# Altium schematic sheet power.SchDoc
size A; SheetNumber: 2; SheetTotal: 9
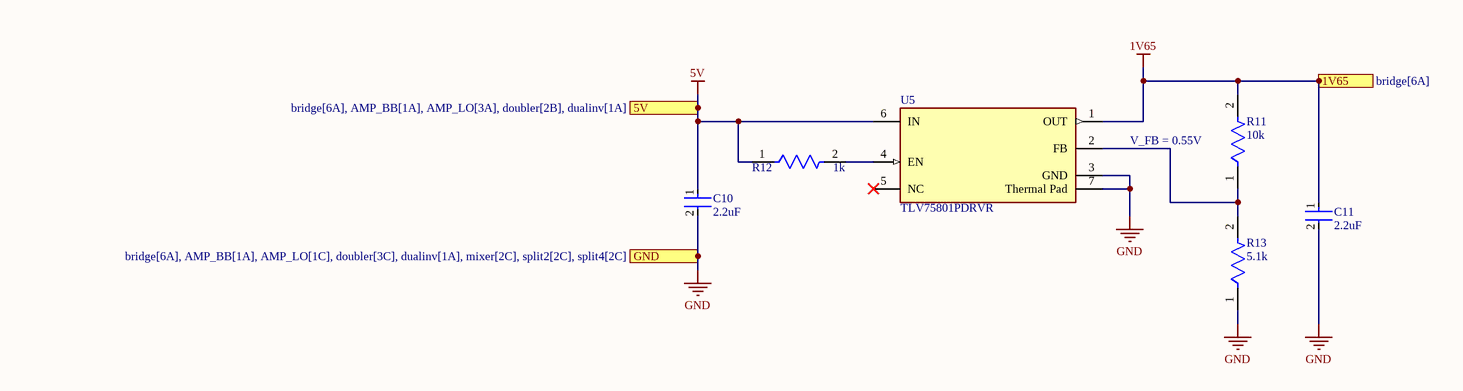
[diagram p0: power.SchDoc]

## Parts
C10  2.2uF  [FP-GRM188-0_1-e0_2_0_5-MFG]
C11  2.2uF  [FP-GRM188-0_1-e0_2_0_5-MFG]
R11  10k  [FP-RC0603-0_55-IPC_C]
R12  1k  [FP-ERJ3G-MFG]
R13  5.1k  [FP-CRCW0603-e3-IPC_C]
U5  TLV75801PDRVR  [FP-DRV0006A-MFG]

## Ports
1V65 (out, see bridge[6A]), 5V (see bridge[6A], AMP_BB[1A], AMP_LO[3A], doubler[2B], dualinv[1A]), GND (see bridge[6A], AMP_BB[1A], AMP_LO[1C], doubler[3C], dualinv[1A], mixer[2C], split2[2C], split4[2C])

## Nets
1V65: C11.1 R11.2 U5.1(OUT) ; port 1V65
5V: C10.1 R12.1 U5.6(IN) ; port 5V
GND: C10.2 C11.2 R13.1 U5.3(GND) U5.7(Thermal_Pad) ; port GND
NetR11_1: R11.1 R13.2 U5.2(FB)
NetR12_2: R12.2 U5.4(EN)

Not connected (* = marked no-connect by the designer): U5 5(NC)*

## Notes on the sheet
- V_FB = 0.55V

## Library data of the parts
C10 C11 = CMP-2006-02836-2: Chip Multilayer Ceramic Capacitors for General Purpose, 0603, 2.2uF, X7R, 15%, 10%, 10V; Manufacturer: Murata; Part Number: GRM188R71A225KE15D; Case Code (Metric): 1608; Height: 0.8mm; Packaging: Cut Tape; Voltage: 10V; Lead Free: Lead Free; Min Operating Temperature: -55°C; Voltage Rating (DC): 10V; Max Operating Temperature: 125°C; Voltage Rating: 10V; Dielectric: X7R; Depth: 0.8mm; Case Code (Imperial): 0603; Termination: SMD/SMT; Case/Package: 0603; Number of Pins: 2; REACH SVHC: No SVHC; Mount: Surface Mount; Width: 0.031inch; Material: Ceramic; Capacitance: 2.2uF; Package Quantity: 1; Weight: 7.1E-05oz; Length: 1.6mm; Thickness: 0.035inch; Tolerance: 10%; Supplier 1: Arrow Electronics; Supplier Part Number 1: GRM188R71A225KE15D
R11 = CMP-2100-03664-2: RES 10K OHM 1% 1/10W 0603; Part Number: ERJ-S03F1002V; Manufacturer: Panasonic; Voltage Rating: 75V; Voltage Rating (DC): 50V; Resistance: 10kR; Power Rating: 100mW; Temperature Coefficient: 100ppm/°C; Depth: 0.8mm; Termination: SMD/SMT; Resistor Type: Thick Film; Series: RC; Construction: Rectangular; Features: Moisture Resistant; Packaging: Tape and Reel; Min Operating Temperature: -55°C; Number of Terminations: 2; Lead Pitch: 0.3mm; RoHS Compliant: Yes; Case/Package: 0603; Resistance Tolerance: 1%; Military Standard: Not; Weight: 7.1E-05oz; Number of Pins: 2; Tolerance: 1%; Length: 1.6mm; Case Code (Imperial): 0603; Lead Free: Lead Free; Width: 0.8mm; Max Power Dissipation: 100mW; Height: 0.45mm; Max Operating Temperature: 155°C; Case Code (Metric): 1608; Size Code: 0603; Supplier 1: Mouser; Supplier Part Number 1: 667-ERJ-S03F1002V
R12 = CMP-2000-00703-2: RES SMD 1K OHM 5% 1/10W 0603; Manufacturer: Panasonic; Manufacturer Part Number: ERJ-3GEYJ102V; Resistance: 1000Ω; Voltage: 75 V; Power Rating: 0.1W; Temperature Coefficient: 200ppm/°C; Voltage Rating: 75V; Value: 1000Ω; Automotive Grade: Grade 0; Category: Res; Ipc Land Pattern Name: RESC16080X45; Mounting Type: surface mount; Automotive: Yes; Temperature: -55°C to +155°C; Lead Free: Yes; Footprint Url: https://industrial.panasonic.com/cdbs/www-data/pdf/RDA0000/DMA0000COL17.pdf; Tolerance: 5%; Device Class L1: Passive Components; Height: 0.55mm; Temperature Range Low: -55°C; RoHS: TRUE; Package: ERJ3G; Temperature Range High: +155°C; Digikey Description: RES SMD 1K OHM 5% 1/10W 0603; Series: ERJ; Device Class L2: Resistors; Device Class L3: Chip SMD Resistors; Mouser Description: Res Thick Film 0603 1K Ohm 5% 1/10W ±200ppm/°C Molded SMD Punched Carrier T/R; Composition: Thick Film; Part Number: ERJ-3GEYJ102V; Supplier 1: Future Electronics; Supplier Part Number 1: 6028511
R13 = CMP-1012-00590-3: RES Thick Film, 5.1kΩ, 1%, 0.1W, 100ppm/°C, 0603; Part Number: ERJ-3EKF5101V; Manufacturer: Panasonic; Power Rating: 100mW; Voltage Rating (DC): 75V; Resistance: 5.1kR; Width: 0.85mm; Depth: 0.85mm; Military Standard: Not; Package Quantity: 5000; Case Code (Metric): 1608; Length: 1.55mm; Weight: 7.1E-05oz; Packaging: Tape and Reel; Temperature Coefficient: 100ppm/°C; Case Code (Imperial): 0603; Lead Free: Lead Free; Radiation Hardening: No; Contact Plating: Tin; Composition: Thick Film; Max Operating Temperature: 155°C; Termination: SMD/SMT; Case/Package: 0603; Min Operating Temperature: -55°C; Tolerance: 1%; Voltage Rating: 75V; Mount: Surface Mount; Height: 0.45mm; Supplier 1: Mouser; Supplier Part Number 1: 667-ERJ-3EKF5101V
U5 = CMP-04917-000312-1: IC REG LIN POS ADJ 500MA 6WSON; Manufacturer: Texas Instruments; Part Number: TLV75801PDRVR; Supplier 1: Mouser; Supplier Part Number 1: 595-TLV75801PDRVR